# Altium schematic sheet Top.SchDoc
size 431 x 279 mm; Author: Shivam Sharma; SheetNumber: 1; SheetTotal: 13; SheetRevision: 1.0
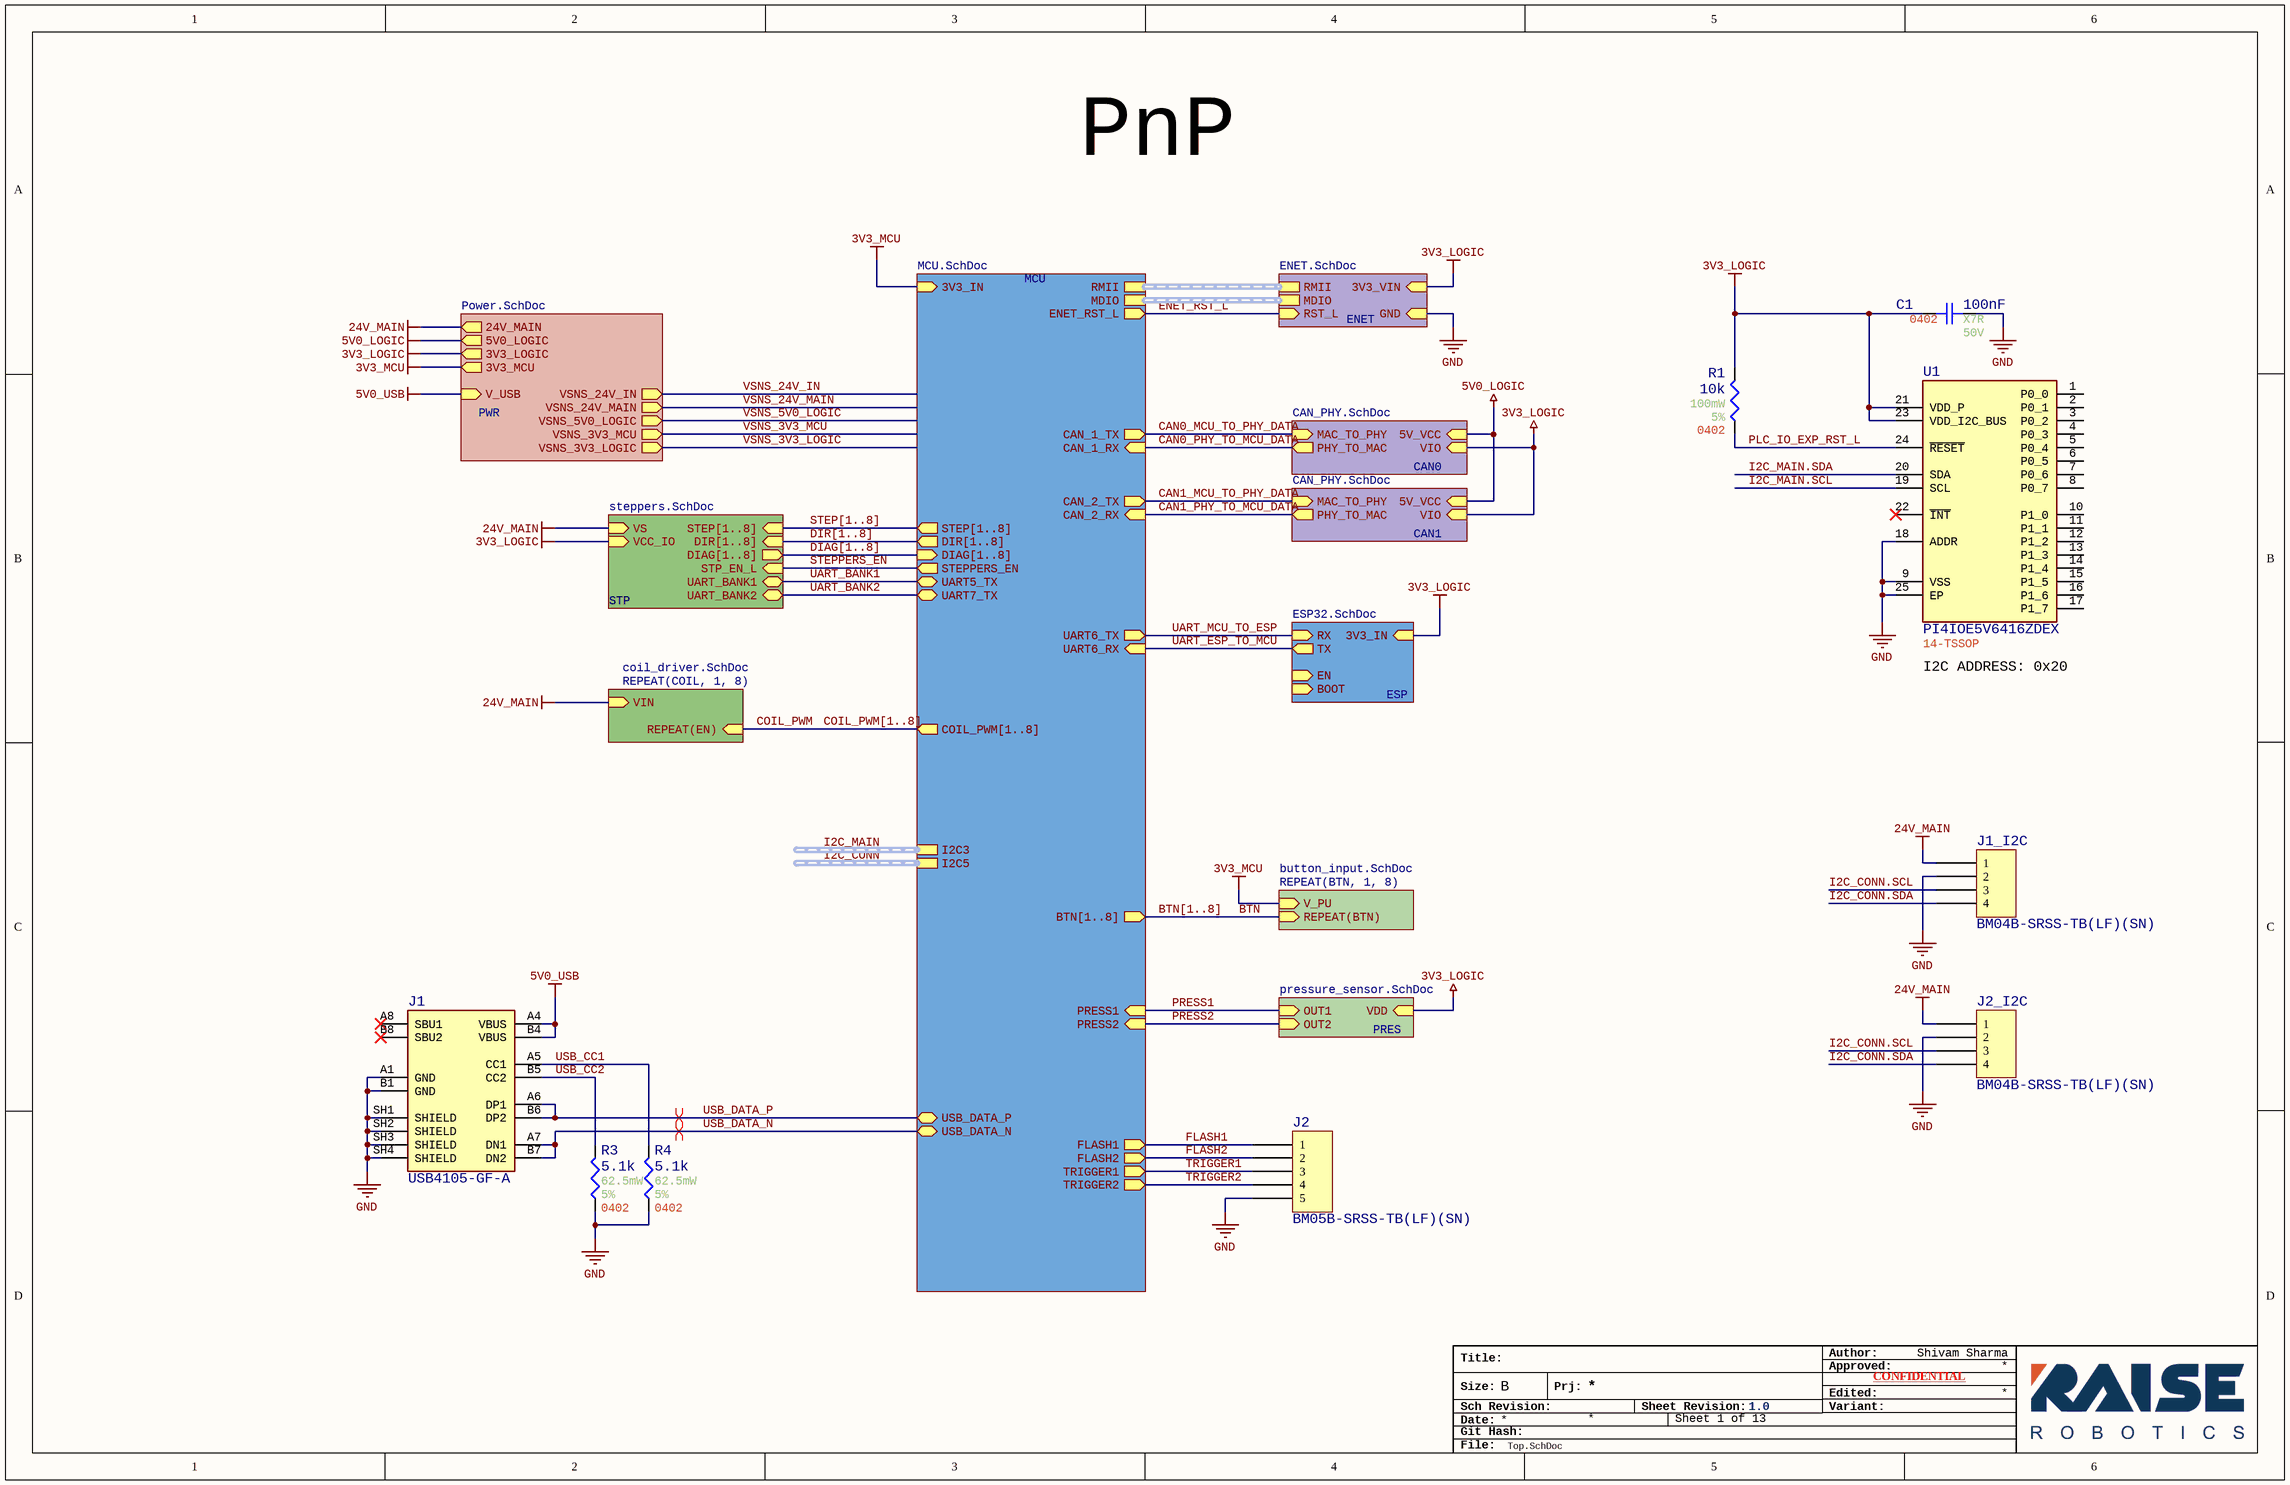
[diagram p0: Top.SchDoc]

## Parts
C1  value 100nF  Temperature Coefficient: X7R  Voltage Rating: 50V  Case/Package: 0402  [Generic 0402 capacitor]  (hidden comment: GRT155R71H104KE01D)
J1  USB4105-GF-A  [USB-C_USB4105-GF-A]
J1_I2C  BM04B-SRSS-TB(LF)(SN)  [JST BM04B-SRSS-TB]
J2  BM05B-SRSS-TB(LF)(SN)  [JST BM05B-SRSS-TB]
J2_I2C  BM04B-SRSS-TB(LF)(SN)  [JST BM04B-SRSS-TB]
R1  value 10k  Power: 100mW  Tolerance: 5%  Case/Package: 0402  [Generic 0402 Resistor]  (hidden comment: ERJ-2GEJ103X)
R3  value 5.1k  Power: 62.5mW  Tolerance: 5%  Case/Package: 0402  [Generic 0402 Resistor]  (hidden comment: RMCF0402JT5K10)
R4  value 5.1k  Power: 62.5mW  Tolerance: 5%  Case/Package: 0402  [Generic 0402 Resistor]  (hidden comment: RMCF0402JT5K10)
U1  PI4IOE5V6416ZDEX  Case/Package: 14-TSSOP  [PI4IOE5V6416ZDEX]

## Sub-sheets
CAN0 = CAN_PHY.SchDoc: 5V_VCC (in), VIO (in), MAC_TO_PHY (in), PHY_TO_MAC (out)
CAN1 = CAN_PHY.SchDoc: 5V_VCC (in), VIO (in), MAC_TO_PHY (in), PHY_TO_MAC (out)
ENET = ENET.SchDoc: 3V3_VIN (in), GND (in), MDIO (harness MDIO), RMII (harness RMII), RST_L (in)
ESP = ESP32.SchDoc: RX (in), TX (out), EN (in), BOOT (in), 3V3_IN (in)
MCU = MCU.SchDoc: RMII (harness RMII), CAN_1_RX (in), CAN_1_TX (out), 3V3_IN (in), MDIO (harness MDIO), ENET_RST_L (out), CAN_2_RX (in), CAN_2_TX (out), STEP[1..8] (out), DIR[1..8] (out), DIAG[1..8] (in), STEPPERS_EN (out), I2C3 (harness I2C), USB_DATA_P (bidir), USB_DATA_N (bidir), COIL_PWM[1..8] (out), UART5_TX (bidir), UART7_TX (bidir), FLASH1 (out), FLASH2 (out), TRIGGER1 (out), TRIGGER2 (out), I2C5 (harness I2C), PRESS2 (in), PRESS1 (in), BTN[1..8] (out), UART6_RX (in), UART6_TX (out)
PRES = pressure_sensor.SchDoc: VDD (in), OUT1 (in), OUT2 (in)
PWR = Power.SchDoc: 24V_MAIN (out), 3V3_MCU (out), 3V3_LOGIC (out), 5V0_LOGIC (out), VSNS_24V_IN (out), VSNS_24V_MAIN (out), VSNS_5V0_LOGIC (out), VSNS_3V3_MCU (out), VSNS_3V3_LOGIC (out), V_USB (in)
REPEAT(BTN, 1, 8) = button_input.SchDoc: V_PU (in), REPEAT(BTN) (in)
REPEAT(COIL, 1, 8) = coil_driver.SchDoc: VIN (in), REPEAT(EN) (in)
STP = steppers.SchDoc: STP_EN_L (in), DIAG[1..8] (out), VS (in), VCC_IO (in), STEP[1..8] (in), DIR[1..8] (in), UART_BANK1 (bidir), UART_BANK2 (bidir)

## Nets
3V3_LOGIC: C1.2 R1.2 U1.21(VDD_P) U1.23(VDD_I2C_BUS) ; sheet PWR/3V3_LOGIC, sheet CAN0/VIO, sheet CAN1/VIO, sheet ENET/3V3_VIN, sheet STP/VCC_IO, sheet PRES/VDD, sheet ESP/3V3_IN
3V3_MCU: sheet MCU/3V3_IN, sheet PWR/3V3_MCU, sheet REPEAT(BTN, 1, 8)/V_PU
5V0_LOGIC: sheet PWR/5V0_LOGIC, sheet CAN0/5V_VCC, sheet CAN1/5V_VCC
5V0_USB: J1.A4(VBUS) J1.B4(VBUS) ; sheet PWR/V_USB
24V_MAIN: J1_I2C.1 J2_I2C.1 ; sheet PWR/24V_MAIN, sheet STP/VS, sheet REPEAT(COIL, 1, 8)/VIN
GND: C1.1 J1.A1(GND) J1.B1(GND) J1.SH1(SHIELD) J1.SH2(SHIELD) J1.SH3(SHIELD) J1.SH4(SHIELD) J1_I2C.2 J2.5 J2_I2C.2 R3.1 R4.1 U1.9(VSS) U1.18(ADDR) U1.25(EP) ; sheet ENET/GND
BTN: sheet REPEAT(BTN, 1, 8)/REPEAT(BTN)
CAN0_MCU_TO_PHY_DATA: sheet MCU/CAN_1_TX, sheet CAN0/MAC_TO_PHY
CAN0_PHY_TO_MCU_DATA: sheet MCU/CAN_1_RX, sheet CAN0/PHY_TO_MAC
CAN1_MCU_TO_PHY_DATA: sheet MCU/CAN_2_TX, sheet CAN1/MAC_TO_PHY
CAN1_PHY_TO_MCU_DATA: sheet MCU/CAN_2_RX, sheet CAN1/PHY_TO_MAC
COIL_PWM: sheet REPEAT(COIL, 1, 8)/REPEAT(EN)
ENET_RST_L: sheet MCU/ENET_RST_L, sheet ENET/RST_L
FLASH1: J2.1 ; sheet MCU/FLASH1
FLASH2: J2.2 ; sheet MCU/FLASH2
I2C_CONN.SCL: J1_I2C.3 J2_I2C.3
I2C_CONN.SDA: J1_I2C.4 J2_I2C.4
I2C_MAIN.SCL: U1.19(SCL)
I2C_MAIN.SDA: U1.20(SDA)
PLC_IO_EXP_RST_L: R1.1 U1.24(~{RESET})
PRESS1: sheet MCU/PRESS1, sheet PRES/OUT1
PRESS2: sheet MCU/PRESS2, sheet PRES/OUT2
STEPPERS_EN: sheet MCU/STEPPERS_EN, sheet STP/STP_EN_L
TRIGGER1: J2.3 ; sheet MCU/TRIGGER1
TRIGGER2: J2.4 ; sheet MCU/TRIGGER2
UART_BANK1: sheet MCU/UART5_TX, sheet STP/UART_BANK1
UART_BANK2: sheet MCU/UART7_TX, sheet STP/UART_BANK2
UART_ESP_TO_MCU: sheet MCU/UART6_RX, sheet ESP/TX
UART_MCU_TO_ESP: sheet MCU/UART6_TX, sheet ESP/RX
USB_CC1: J1.A5(CC1) R4.2
USB_CC2: J1.B5(CC2) R3.2
USB_DATA_N: J1.A7(DN1) J1.B7(DN2) ; sheet MCU/USB_DATA_N
USB_DATA_P: J1.A6(DP1) J1.B6(DP2) ; sheet MCU/USB_DATA_P
VSNS_3V3_LOGIC: sheet PWR/VSNS_3V3_LOGIC
VSNS_3V3_MCU: sheet PWR/VSNS_3V3_MCU
VSNS_5V0_LOGIC: sheet PWR/VSNS_5V0_LOGIC
VSNS_24V_IN: sheet PWR/VSNS_24V_IN
VSNS_24V_MAIN: sheet PWR/VSNS_24V_MAIN

Not connected (* = marked no-connect by the designer): J1 A8(SBU1)* B8(SBU2)*; U1 1(P0_0) 2(P0_1) 3(P0_2) 4(P0_3) 5(P0_4) 6(P0_5) 7(P0_6) 8(P0_7) 10(P1_0) 11(P1_1) 12(P1_2) 13(P1_3) 14(P1_4) 15(P1_5) 16(P1_6) 17(P1_7) 22(~{INT})*

## Buses and harness runs
bus BTN[1..8] = sheet MCU/BTN[1..8]
bus COIL_PWM[1..8] = sheet MCU/COIL_PWM[1..8]
bus DIAG[1..8] = sheet MCU/DIAG[1..8] = sheet STP/DIAG[1..8]
bus DIR[1..8] = sheet MCU/DIR[1..8] = sheet STP/DIR[1..8]
bus STEP[1..8] = sheet MCU/STEP[1..8] = sheet STP/STEP[1..8]
harness I2C_CONN = sheet MCU/I2C5
harness I2C_MAIN = sheet MCU/I2C3
harness sheet ENET/MDIO = sheet MCU/MDIO
harness sheet ENET/RMII = sheet MCU/RMII

## Layout directives
differential pair; differential pair class USB: USB_DATA_N, USB_DATA_P

## Notes on the sheet
- PnP
- (near U1) I2C ADDRESS: 0x20
- Title:
- Author:
- Approved:
- Size:
- Date:
- Git Hash:
- Sch Revision:
- B
- Prj:
- Sheet Revision:
- Variant:
- Edited:
- CONFIDENTIAL
- File:

## Library data of the parts
C1 = CMP-001-00084-12: Ceramic Capacitor, Multilayer, Ceramic, 50V, 10% +Tol, 10% -Tol, X7R, 15% TC, 0.1uF, Surface Mount, 0402; AECQ: Yes; Reach SVHC Compliant: Yes; Mounting Technology: Surface Mount; Termination: Wraparound; Pins: 2; Packaging: Tape and Reel; Package Shape: Rectangular; Multilayer: Yes; Tolerance: 10%; Max Operating Temperature: 125°C; Terminal Finish: Nickel; Capacitor Type: Ceramic; Dielectric Material: Ceramic; Min Operating Temperature: -55°C; RoHS Compliant: Yes
J1 = CMP-002-00138-1: USB Connector, 24 Contact(s), Female, Right Angle, Solder Terminal, Locking, Receptacle; Manufacturer: Molex; Connector Type: USB-C; Max Current Rating: 5A; Voltage Rating: 20V; Case/Package: TH USB-C; Height: 3.46mm; Pins: 16; Max Operating Temperature: 85°C; Gender: Female; Min Operating Temperature: -40°C
J1_I2C J2_I2C = BM04B-SRSS-TB(LF)(SN): CONN HEADER SMD 4POS 1MM; Manufacturer: JST Sales America Inc.; Current Rating (Amps): 0.7A; Material Flammability Rating: UL94 V-0; Number of Positions: 4; Number of Positions Loaded: All; Pitch - Mating: 0.039" (1.00mm); Row Spacing - Mating: -25°C ~ 85°C; Shrouding: Shrouded - 4 Wall; Style: Board to Cable/Wire; Voltage Rating: 50V; Part Number: BM04B-SRSS-TB(LF)(SN); ComponentLink1Description: Datasheet; ComponentLink1URL: http://www.jst-mfg.com/product/pdf/eng/eSH.pdf; ComponentLink2Description: DigiKey Link; ComponentLink2URL: http://digikey.com/product-detail/en/jst-sales-america-inc/BM04B-SRSS-TB-LF-SN/455-1790-1-ND/926861; Connector Type: Header; Contact Finish - Mating: Tin; Contact Finish - Post: Tin; Contact Material: Copper Alloy; Contact Shape: Square; Contact Type: Male Pin; Fastening Type: Push-Pull; Features: Solder Retention; Insulation Color: Natural; Insulation Height: 0.167" (4.25mm); Insulation Material: Polyamide (PA), Nylon; LastUpdated: 8/24/2020 1:45:53 PM; Lifecycle Status: Active; Minimum Order: 1; Mounting Type: Surface Mount; Number of Rows: 1; Operating Temperature: -25°C ~ 85°C; Packaging: TapeAndReel; PartId: 16; Part Status: Active; Price: 0.29; Series: SR; Supplier 1: DigiKey; Supplier Part Number 1: 455-1790-1-ND; Termination: Solder
J2 = BM05B-SRSS-TB(LF)(SN): CONN HEADER SMD 5POS 1MM; Manufacturer: JST Sales America Inc.; Current Rating (Amps): 0.7A; Material Flammability Rating: UL94 V-0; Number of Positions: 5; Number of Positions Loaded: All; Pitch - Mating: 0.039" (1.00mm); Shrouding: Shrouded - 4 Wall; Style: Board to Cable/Wire; Voltage Rating: 50V; Part Number: BM05B-SRSS-TB(LF)(SN); ComponentLink1Description: Datasheet; ComponentLink1URL: http://www.jst-mfg.com/product/pdf/eng/eSR.pdf; ComponentLink2Description: DigiKey Link; ComponentLink2URL: http://digikey.com/product-detail/en/jst-sales-america-inc/BM05B-SRSS-TB-LF-SN/455-1791-1-ND/926862; Connector Type: Header; Contact Finish - Mating: Tin; Contact Finish - Post: Tin; Contact Material: Copper Alloy; Contact Shape: Square; Contact Type: Male Pin; Fastening Type: Push-Pull; Features: Solder Retention; Insulation Color: Natural; Insulation Height: 0.167" (4.25mm); Insulation Material: Polyamide (PA), Nylon; LastUpdated: 1/12/2020 10:14:00 PM; Lifecycle Status: Active; Minimum Order: 1; Mounting Type: Surface Mount; Number of Rows: 1; Operating Temperature: -25°C ~ 85°C; Packaging: TapeAndReel; PartId: 18; Part Status: Active; Price: 0.35; Series: SR; Supplier 1: DigiKey; Supplier Part Number 1: 455-1791-1-ND; Termination: Solder
R1 = CMP-009-00185-9: Res Thick Film 0402 10K Ohm 5% 1/10W ±200ppm/°C Molded SMD Punched Carrier T/R; AECQ: No; Pins: 2; Max Operating Temperature: 155°C; RoHS Compliant: Yes; Min Operating Temperature: -55°C; Mounting Technology: Surface Mount
R3 R4 = CMP-009-00220-1: Res Thick Film 0402 5.1K Ohm 5% 0.063W ±100ppm/°C Molded SMD Paper T/R; AECQ: Yes; Max Operating Temperature: 155°C; Pins: 2; Mounting Technology: Surface Mount; RoHS Compliant: Yes; Min Operating Temperature: -55°C
U1 = CMP-031-00013-2: 16-bit I2C General Purpose IO Expander with Interrupt, Reset, -40 to 85 °C, RoHS; Number of Circuits: 1; AECQ: No; Min Supply Voltage: 1.65V; Max Supply Voltage: 5.5V; Number of Terminals: 24; Schedule B: 8542390000, 8542390000; Pins: 14; RoHS: Compliant; Max Operating Temperature: 85°C; Lifecycle Status: Production; Terminal Pitch: 500µm; Width: 4mm; Min Operating Temperature: -40°C; REACH SVHC: Yes; Length: 4mm; Height - Seated (Max): 900µm; MPN: PI4IOE5V6416ZDEX